# EasyEDA schematic Rotary_Encoder_Board.json
TITLE: Sheet_1; REV: 1.0; Date: 2023-09-12; Sheet: 1/1; Drawn By: AmirB; Company: Your Company
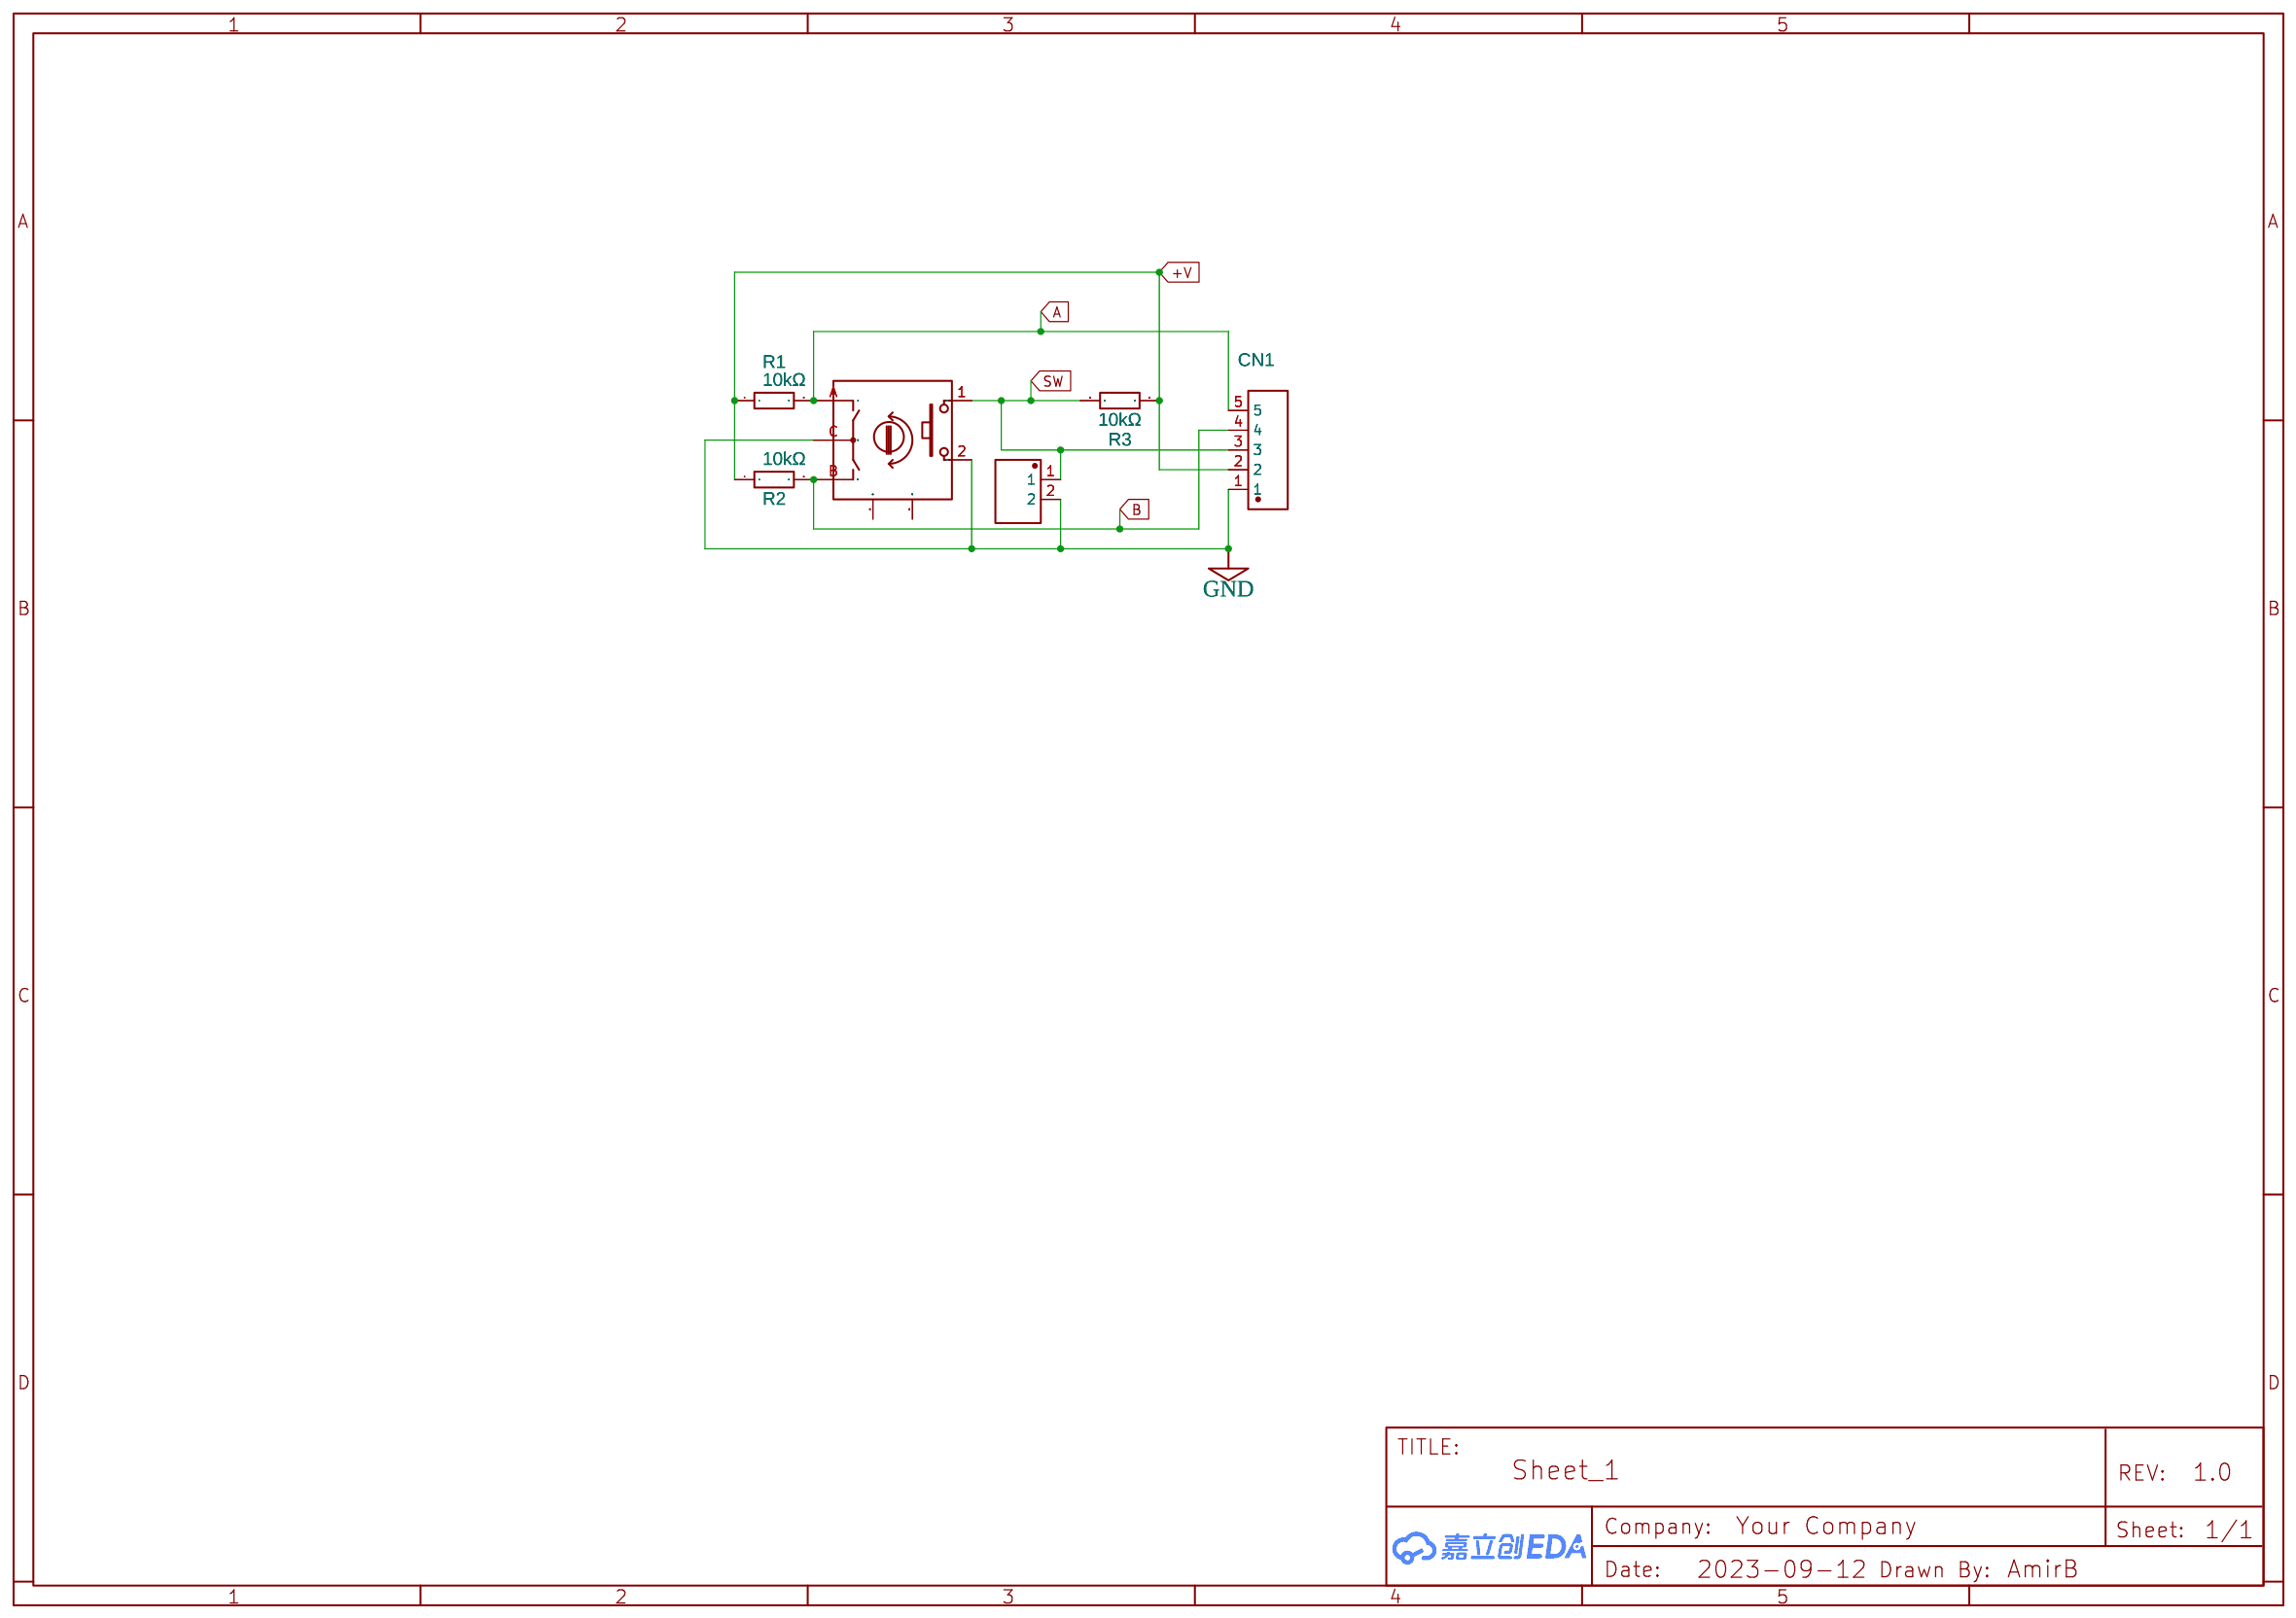
[diagram p0: schematic sheet]

## Parts
CN1  XH-5AW_C722878  [CONN-TH_XH-5AW]
R1  10kΩ  [R0603]
R2  10kΩ  [R0603]
R3  10kΩ  [R0603]
SW1  PEC11R-4015F-S0024  [SW-TH_PEC11R-4XXXF-SXXXX]
VIN1  640456-2  [CONN-TH_KF2510-2A]

## Library data of the parts
CN1 = XH-5AW_C722878: Contributor: LCSC; Supplier: LCSC; Supplier Part: C722878; Manufacturer: CAX; JLCPCB Part Class: Extended Part; Package Display: No
R1-R3 = 0603WAF1002T5E: Supplier: LCSC; Manufacturer: UNI-ROYAL(厚声); Supplier Part: C25804; JLCPCB Part Class: Basic Part; Package Display: No
SW1 = PEC11R-4015F-S0024: Contributor: LCSC; Supplier: LCSC; Supplier Part: C143789; Manufacturer: BOURNS; JLCPCB Part Class: Extended Part; Package Display: No
VIN1 = 640456-2: Supplier: LCSC; Manufacturer: TE Connectivity; Supplier Part: C86502; JLCPCB Part Class: Extended Part; Package Display: No

## Nets
GND: CN1.1 SW1.2 SW1.C VIN1.2
+V: CN1.2 R1.1 R2.1 R3.1
A: CN1.5 R1.2 SW1.A
B: CN1.4 R2.2 SW1.B
SW: CN1.3 R3.2 SW1.1 VIN1.1

Not connected (* = marked no-connect by the designer): SW1 MT1 MT2
